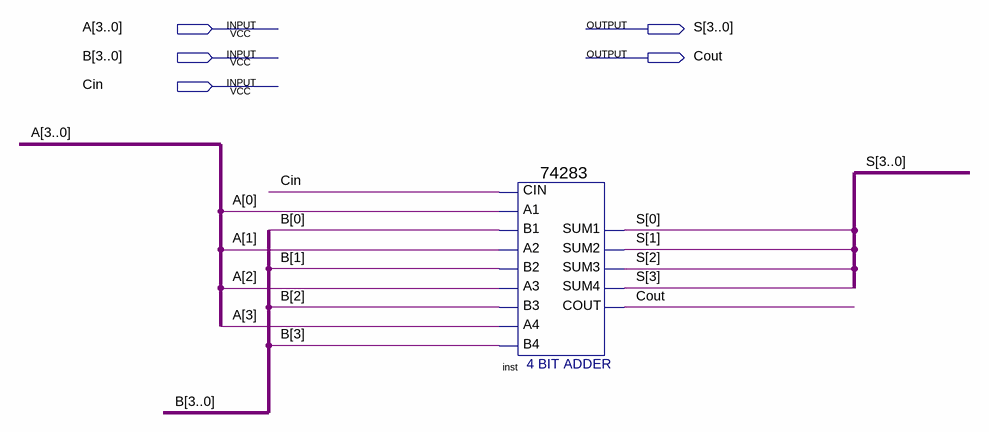
[diagram p0: schematic sheet]
// Quartus schematic ttl74283.bdf as structural Verilog: 1 symbols, 5 pins
module ttl74283 (
  input  [3:0] A,
  input  [3:0] B,
  input  Cin,
  output [3:0] S,
  output Cout
);

  \74283  inst (
    .CIN(Cin), .A1(A[0]), .A2(A[1]), .B2(B[1]), .A3(A[2]), .A4(A[3]), .B4(B[3]), .B1(B[0]), .B3(B[2]),
    .SUM4(S[3]), .COUT(Cout), .SUM1(S[0]), .SUM2(S[1]), .SUM3(S[2]));
endmodule
